# EAGLE design tinyha_jumper (EAGLE 7.5.0)
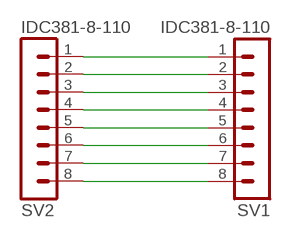
[diagram p0: schematic, sheet 1]

## Parts
SV1  IDC381-8-110  MA08-1-IDC  [IDC381-8]
SV2  IDC381-8-110  MA08-1-IDC  [IDC381-8]

## Nets
N$1: SV1.1 SV2.1
N$2: SV1.2 SV2.2
N$3: SV1.3 SV2.3
N$4: SV1.4 SV2.4
N$5: SV1.5 SV2.5
N$6: SV1.6 SV2.6
N$7: SV1.7 SV2.7
N$8: SV1.8 SV2.8

## Library data of the parts
SV1 SV2 = custom:MA08-1: PIN HEADER

## Board
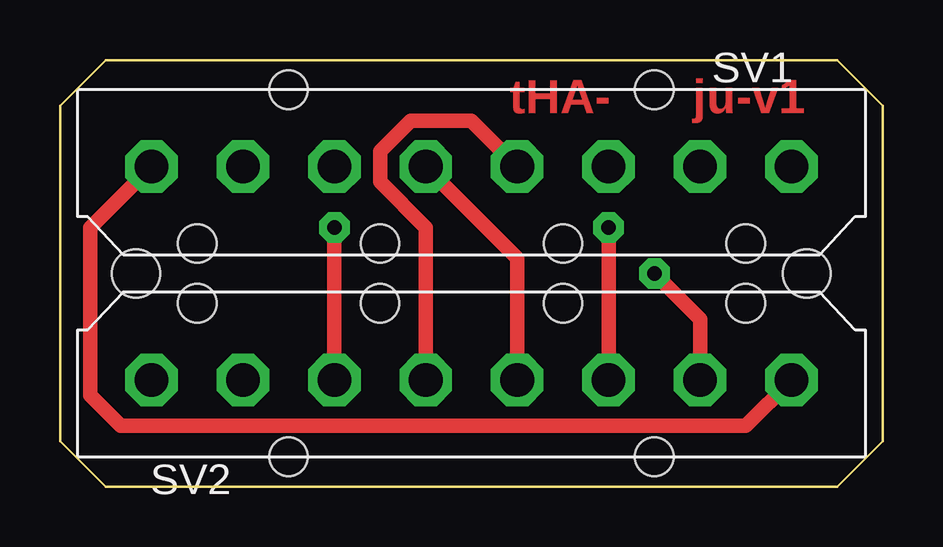
[diagram p1: board, top side]
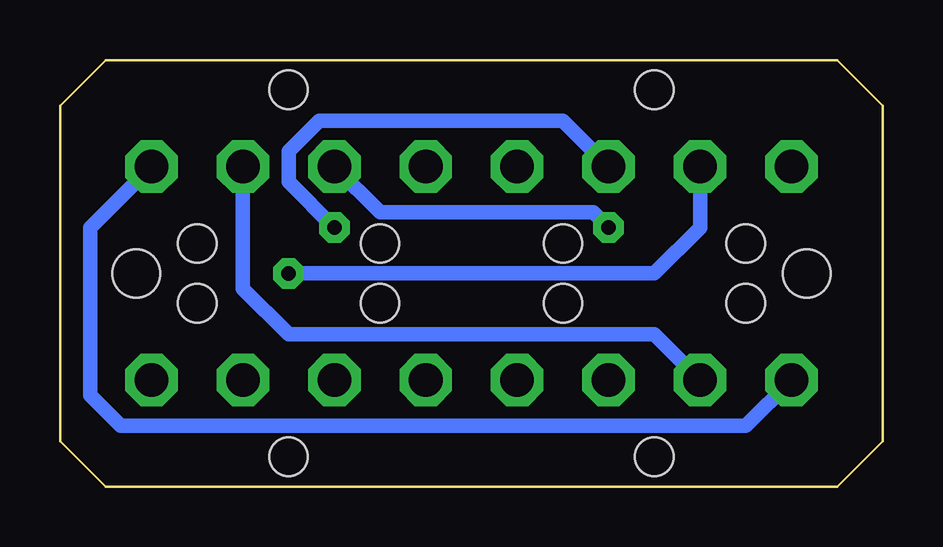
[diagram p2: board, bottom side, seen from below]

Size 34.29 x 17.78 mm. Coordinates in mm from the lower left corner, seen from the top.
Outline: 32.38,17.78 1.91,17.78 0,15.88 0,1.91 1.91,0 32.38,0 34.29,1.91 34.29,15.88 32.38,17.78
Copper layers (1*16): Top 0.035mm / dielectric 1.5mm / Bottom 0.035mm
Design rules "temp *": minimum track width 10mil, minimum drill 0.5mm, track to track 0.2mm, track to pad 0.2mm, pad to pad 0.2mm, via to via 0.2mm, smd to smd 0mil, copper to edge 16mil, drill to drill 8mil, minimum pad ring 14mil, minimum via ring 10mil, stop-mask expansion 4mil, vias tented up to drill 0.6mm, thermal gap 16mil
Holes 2 mm at 3.17,8.89 31.11,8.89

### Footprints (pad centres in the part's own frame; a part is rotated, then mirrored left to right if it is on the bottom)
IDC381-8 = drill 1.4 pad 2.184 octagon: 1 -13.335,0; 2 -9.525,0; 3 -5.715,0; 4 -1.905,0; 5 1.905,0; 6 5.715,0; 7 9.525,0; 8 13.335,0 | hole 1.6: -11.43,-3.2; -3.81,-3.2; 3.81,-3.2; 11.43,-3.2; -7.62,3.2; 7.62,3.2

### Placement (x,y rotation side)
SV1  17.14,13.34 0 top
SV2  17.14,4.45 180 top

### Tracks (layer width: path | path; a pad name or v marks a point on that pad's centre or on a via)
N$1
  Top 0.61: SV2.1 28.57,2.54 2.54,2.54 1.27,3.81 1.27,10.79 SV1.1
N$2  (via drill 0.6 pad 1.27)
  Top 0.61: v24.77,8.89 26.67,6.99 SV2.2
  Bottom 0.61: SV1.2 7.62,10.79 9.53,8.89 v24.77,8.89
N$3  (via drill 0.6 pad 1.27)
  Top 0.61: SV2.3 v22.86,10.79
  Bottom 0.61: v22.86,10.79 24.77,12.7 24.77,13.97 23.5,15.24 13.34,15.24 SV1.3
N$4
  Top 0.61: SV1.4 19.05,9.53 SV2.4
N$5
  Top 0.61: SV2.5 15.24,10.79 13.34,12.7 13.34,13.97 14.61,15.24 17.14,15.24 SV1.5
N$6  (via drill 0.6 pad 1.27)
  Top 0.61: SV2.6 v11.43,10.79
  Bottom 0.61: v11.43,10.79 12.06,11.43 20.95,11.43 SV1.6
N$7
  Bottom 0.61: SV2.7 9.53,6.35 24.77,6.35 26.67,8.26 SV1.7
N$8
  Bottom 0.61: SV2.8 5.71,2.54 31.75,2.54 33.02,3.81 33.02,10.79 SV1.8

### Text on the board
Top: tHA- | ju-v1